# Altium schematic sheet DVI.SchDoc: Iris
size A3; Organization: Toradex AG; Address1: Altsagenstrasse 5; Address2: Horw; Address3: 6048; Address4: Switzerland; DocumentNumber: 11; Revision: V2.0; SheetNumber: 11; SheetTotal: 16
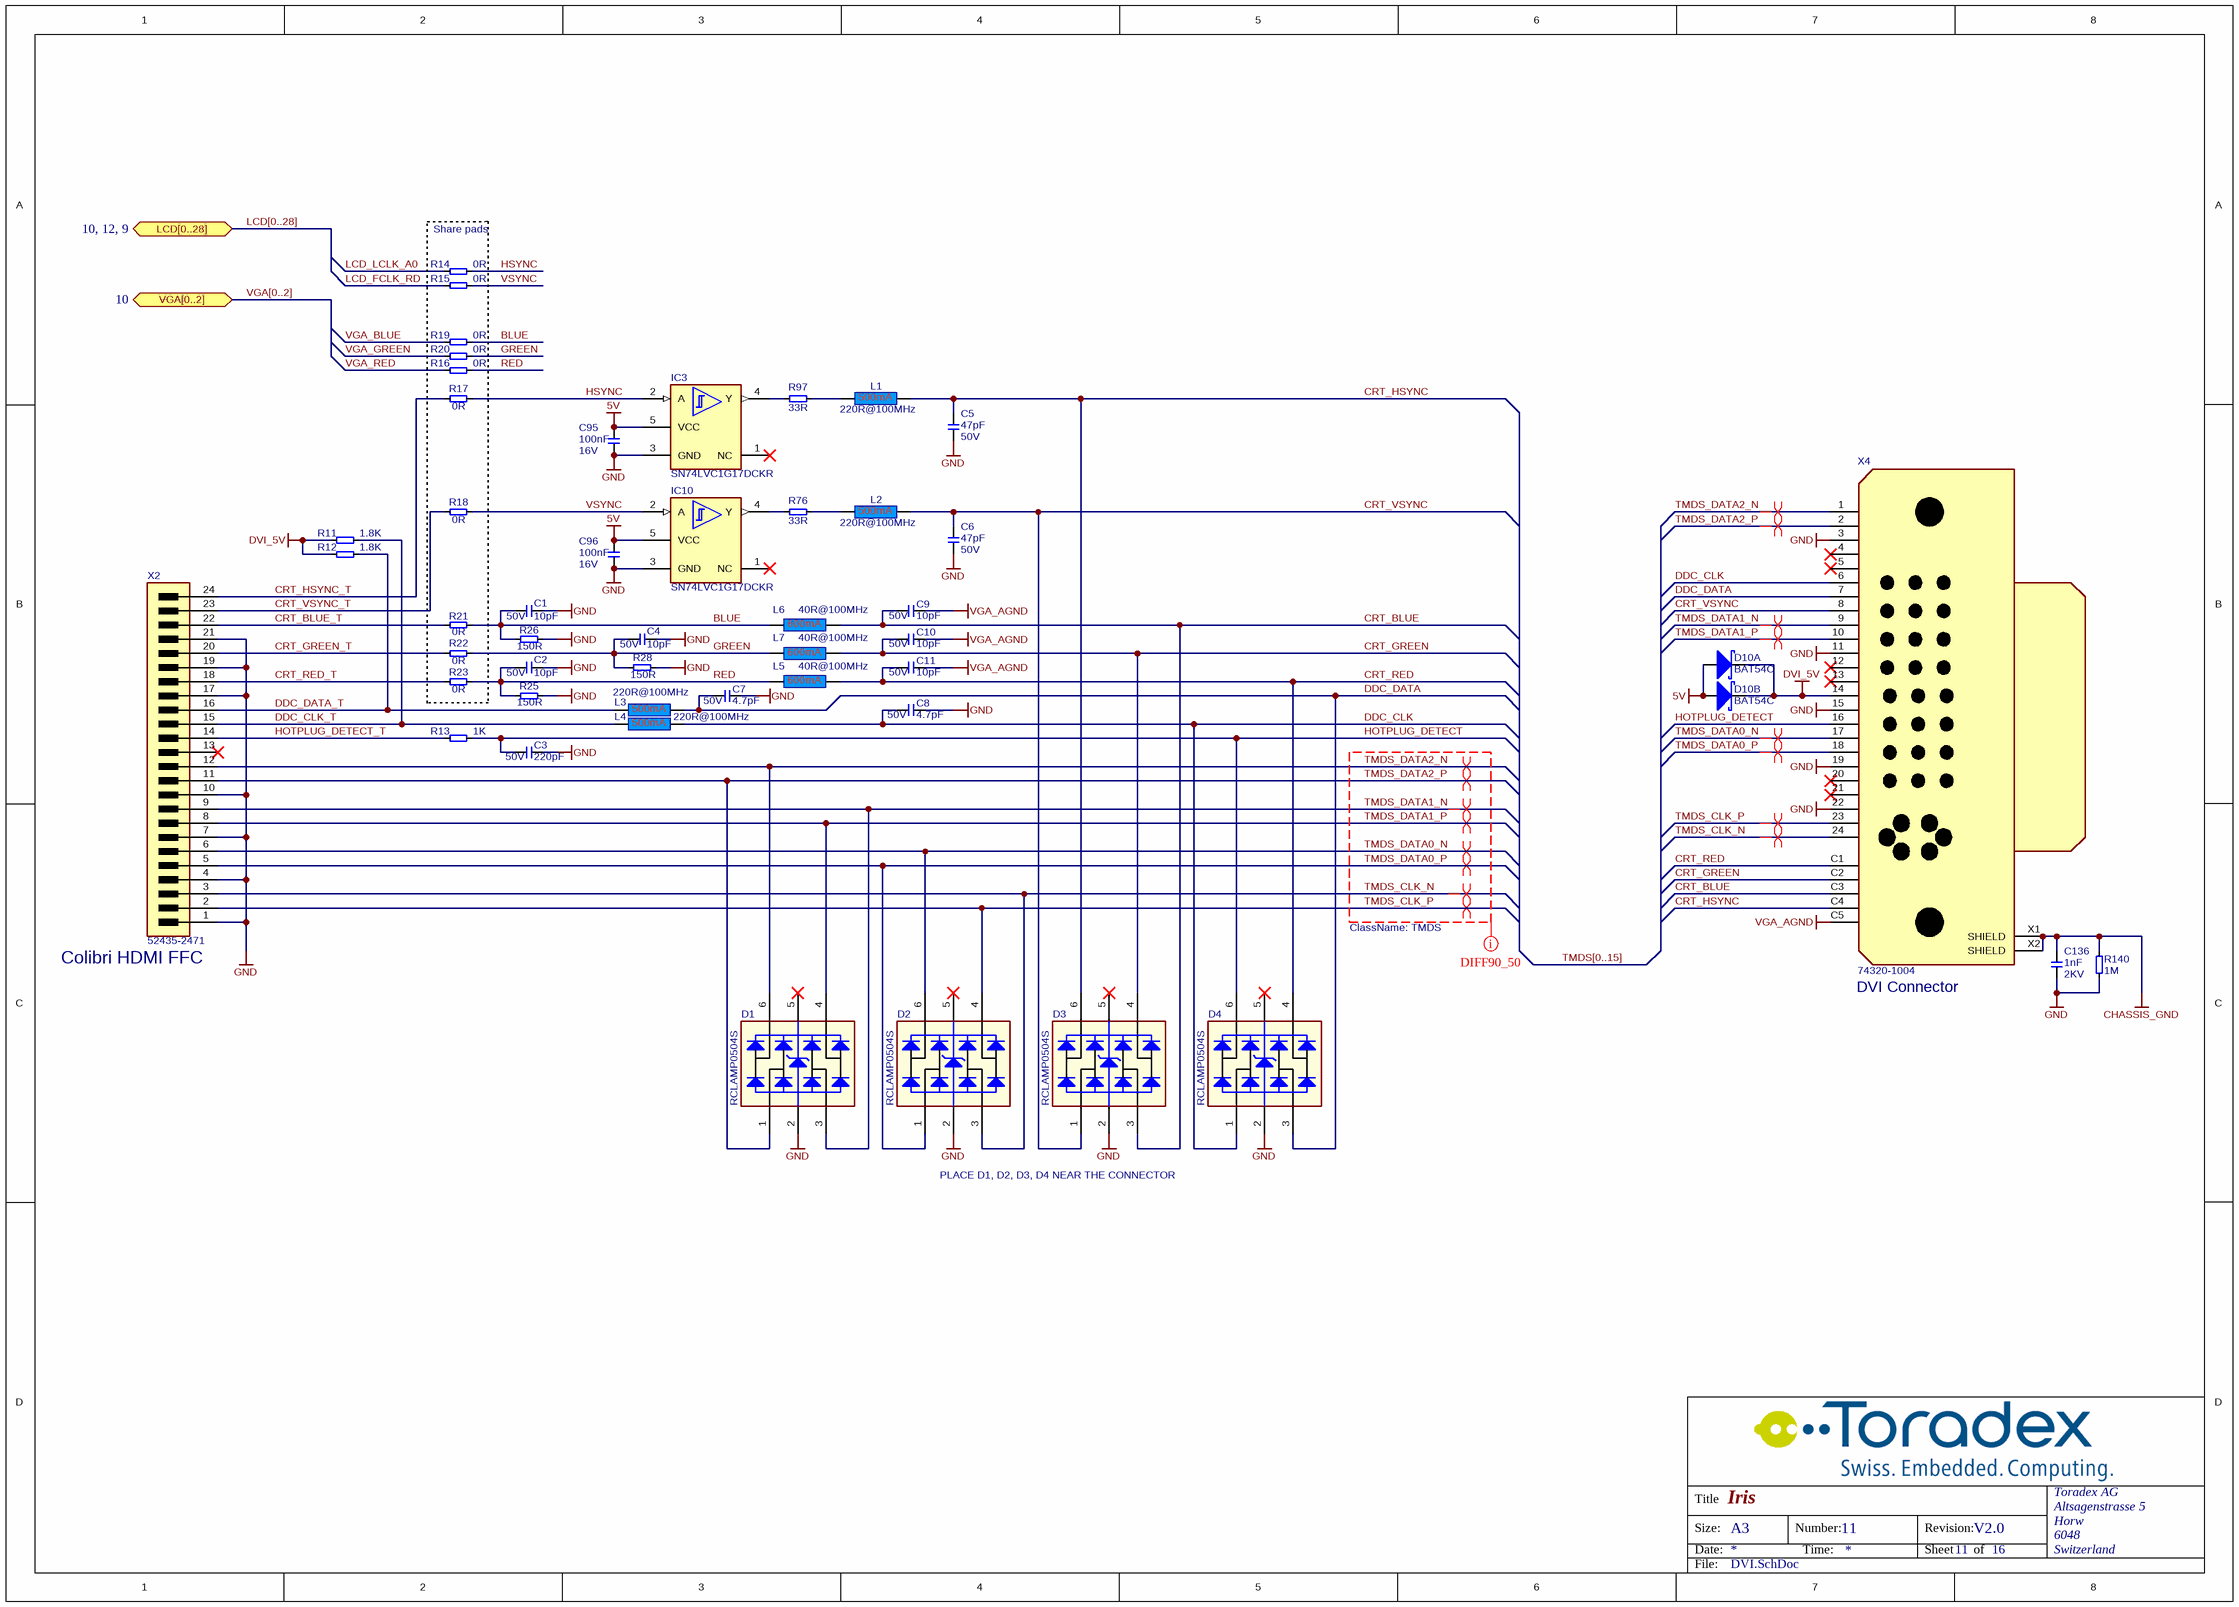
[diagram p0: DVI.SchDoc]

## Parts
C1  Rating: 50V  [CAPC1005X60N]  (hidden comment: 10pF)
C2  Rating: 50V  [CAPC1005X60N]  (hidden comment: 10pF)
C3  Rating: 50V  [CAPC1005X60N]  (hidden comment: 220pF)
C4  Rating: 50V  [CAPC1005X60N]  (hidden comment: 10pF)
C5  Rating: 50V  [CAPC1005X60N]  (hidden comment: 47pF)
C6  Rating: 50V  [CAPC1005X60N]  (hidden comment: 47pF)
C7  Rating: 50V  [CAPC1005X60N]  (hidden comment: 4.7pF)
C8  Rating: 50V  [CAPC1005X60N]  (hidden comment: 4.7pF)
C9  Rating: 50V  [CAPC1005X60N]  (hidden comment: 10pF)
C10  Rating: 50V  [CAPC1005X60N]  (hidden comment: 10pF)
C11  Rating: 50V  [CAPC1005X60N]  (hidden comment: 10pF)
C95  Rating: 16V  [CAPC1005X60N]  (hidden comment: 100nF)
C96  Rating: 16V  [CAPC1005X60N]  (hidden comment: 100nF)
C136  Rating: 2KV  [T_CAPC1206X180N]  (hidden comment: 1nF)
D1  RCLAMP0504S  [T_SOT95P285X90-6N]
D2  RCLAMP0504S  [T_SOT95P285X90-6N]
D3  RCLAMP0504S  [T_SOT95P285X90-6N]
D4  RCLAMP0504S  [T_SOT95P285X90-6N]
D10  BAT54C  [SOT95P230X110-3N]  (parts A,B of 2)
IC3  SN74LVC1G17DCKR  [SOT65P210X110-5N]
IC10  SN74LVC1G17DCKR  [SOT65P210X110-5N]
L1  220R@100MHz  [INDC1005X55N]
L2  220R@100MHz  [INDC1005X55N]
L3  220R@100MHz  [INDC1005X55N]
L4  220R@100MHz  [INDC1005X55N]
L5  40R@100MHz  [INDC1608X95N]
L6  40R@100MHz  [INDC1608X95N]
L7  40R@100MHz  [INDC1608X95N]
R11  1.8K  [RESC1005X40N]
R12  1.8K  [RESC1005X40N]
R13  1K  [RESC1005X40N]
R14  0R  [T_RESC0603X30N]
R15  0R  [T_RESC0603X30N]
R16  0R  [T_RESC0603X30N]
R17  0R  [T_RESC0603X30N]
R18  0R  [T_RESC0603X30N]
R19  0R  [T_RESC0603X30N]
R20  0R  [T_RESC0603X30N]
R21  0R  [T_RESC0603X30N]
R22  0R  [T_RESC0603X30N]
R23  0R  [T_RESC0603X30N]
R25  150R  [RESC1005X40N]
R26  150R  [RESC1005X40N]
R28  150R  [RESC1005X40N]
R76  33R  [RESC1005X40N]
R97  33R  [RESC1005X40N]
R140  1M  [T_RESC0603X30N]
X2  52435-2471  [T_MOLEX_52435-2471]
X4  Manufacturer Part No.: 74320-1004  [T_MOLEX_74320-1004]  (hidden comment: CON-Molex-74320-1004-31)

## Blocks framed on the sheet
Share pads: R14-R23

## Ports
LCD[0..28] (bidir, see 10, 12, 9), VGA[0..2] (bidir, see 10)

## Nets
5V: C95.2 C96.2 D10.1 D10.2 IC3.5(VCC) IC10.5(VCC)
CHASSIS_GND: C136.2 R140.2 X4.X1(SHIELD) X4.X2(SHIELD)
DVI_5V: D10.3 R11.2 R12.2 X4.14(VDD_DVI)
GND: C1.2 C2.2 C3.2 C4.2 C5.2 C6.2 C7.2 C8.2 C95.1 C96.1 C136.1 D1.2 D2.2 D3.2 D4.2 IC3.3(GND) IC10.3(GND) R25.2 R26.2 R28.2 R140.1 X2.1(GND) X2.4(GND) X2.7(GND) X2.10(GND) X2.17(GND) X2.19(GND) X2.21(GND) X4.3(GND) X4.11(GND) X4.15(GND) X4.19(GND) X4.22(GND)
VGA_AGND: C9.2 C10.2 C11.2 X4.C5(GND)
BLUE: C1.1 L6.1 R19.1 R21.1 R26.1
CRT_BLUE: C9.1 D3.3 L6.2 X4.C3(CRT_BLUE)
CRT_BLUE_T: R21.2 X2.22(CRT_BLUE)
CRT_GREEN: C10.1 D3.4 L7.2 X4.C2(CRT_GREEN)
CRT_GREEN_T: R22.2 X2.20(CRT_GREEN)
CRT_HSYNC: C5.1 D3.6 L1.2 X4.C4(CRT_HSYNC)
CRT_HSYNC_T: R17.1 X2.24(CRT_HSYNC)
CRT_RED: C11.1 D4.4 L5.2 X4.C1(CRT_RED)
CRT_RED_T: R23.2 X2.18(CRT_RED)
CRT_VSYNC: C6.1 D3.1 L2.2 X4.8(CRT_VSYNC)
CRT_VSYNC_T: R18.1 X2.23(CRT_VSYNC)
DDC_CLK: C8.1 D4.1 L4.2 X4.6(DDC_CLK)
DDC_CLK_T: L4.1 R11.1 X2.15(DDC_CLK)
DDC_DATA: C7.1 D4.3 L3.2 X4.7(DDC_DATA)
DDC_DATA_T: L3.1 R12.1 X2.16(DDC_DATA)
GREEN: C4.1 L7.1 R20.1 R22.1 R28.1
HOTPLUG_DETECT: C3.1 D4.6 R13.2 X4.16(HOTPLUG_DETECT)
HOTPLUG_DETECT_T: R13.1 X2.14(HOTPLUG_DETECT)
HSYNC: IC3.2(A) R14.2 R17.2
LCD_FCLK_RD: R15.1
LCD_LCLK_A0: R14.1
RED: C2.1 L5.1 R16.1 R23.1 R25.1
TMDS_CLK_N: D2.3 X2.3(TMDS_CLK_N) X4.24(TMDS_CLK_N)
TMDS_CLK_P: D2.4 X2.2(TMDS_CLK_P) X4.23(TMDS_CLK_P)
TMDS_DATA0_N: D2.6 X2.6(TMDS_DATA0_N) X4.17(TMDS_DATA0_N)
TMDS_DATA0_P: D2.1 X2.5(TMDS_DATA0_P) X4.18(TMDS_DATA0_P)
TMDS_DATA1_N: D1.3 X2.9(TMDS_DATA1_N) X4.9(TMDS_DATA1_N)
TMDS_DATA1_P: D1.4 X2.8(TMDS_DATA1_P) X4.10(TMDS_DATA1_P)
TMDS_DATA2_N: D1.6 X2.12(TMDS_DATA2_N) X4.1(TMDS_DATA2_N)
TMDS_DATA2_P: D1.1 X2.11(TMDS_DATA2_P) X4.2(TMDS_DATA2_P)
VGA_BLUE: R19.2
VGA_GREEN: R20.2
VGA_RED: R16.2
VSYNC: IC10.2(A) R15.2 R18.2
NetIC3_4: IC3.4(Y) R97.1
NetIC10_4: IC10.4(Y) R76.1
NetL1_1: L1.1 R97.2
NetL2_1: L2.1 R76.2

Not connected (* = marked no-connect by the designer): D1 5*; D2 5*; D3 5*; D4 5*; IC3 1(NC)*; IC10 1(NC)*; X2 13(VDD)*; X4 4(TMDS_DATA4_N)* 5(TMDS_DATA4_P)* 12(TMDS_DATA3_N)* 13(TMDS_DATA3_P)* 20(TMDS_DATA5_N)* 21(TMDS_DATA5_P)*

## Buses and harness runs
bus LCD[0..28] = port LCD[0..28]
bus TMDS[0..15]
bus VGA[0..2] = port VGA[0..2]

## Layout directives
differential pair: TMDS_CLK_N, TMDS_CLK_P, TMDS_DATA0_N, TMDS_DATA0_P, TMDS_DATA1_N, TMDS_DATA1_P, TMDS_DATA2_N, TMDS_DATA2_P
net class TMDS: TMDS_CLK_N, TMDS_CLK_P, TMDS_DATA0_N, TMDS_DATA0_P, TMDS_DATA1_N, TMDS_DATA1_P, TMDS_DATA2_N, TMDS_DATA2_P

## Notes on the sheet
- (near X2) Colibri HDMI FFC
- (near X4) DVI Connector
- PLACE D1, D2, D3, D4 NEAR THE CONNECTOR
- Title
- Size:
- Date:
- A3
- Number:
- Time:
- Revision:
- Sheet
- of
- File:

## Library data of the parts
C1 C2 C4 C9-C11 = C-NP0-10pF-50V-10%-0402: Capacitor Ceramic NP0 10pF 50V 10% 0402; Tolerance: 10%; Type: NP0; Value: 10pF
C3 = C-X7R-220pF-50V-10%-0402: Capacitor Ceramic X7R 220pF 50V 10% 0402; Tolerance: 10%; Type: X7R; Value: 220pF
C5 C6 = C-NP0-47pF-50V-5%-0402: Capacitor Ceramic NP0 47pF 50V 5% 0402; Tolerance: 5%; Type: NP0; Value: 47pF
C7 C8 = C-NP0-4.7pF-50V-10%-0402: Capacitor Ceramic NP0  4.7pF 50V 10% 0402; Tolerance: 10%; Type: NP0; Value: 4.7pF
C95 C96 = C-X7R-100nF-16V-10%-0402: Capacitor Ceramic X7R 100nF 16V 10% 0402; Tolerance: 10%; Type: X7R; Value: 100nF
C136 = C-X7R-1nF-2KV-10%-1206: Capacitor Ceramic X7R 1nF 2KV 10% 1206; Tolerance: 10%; Type: X7R; Value: 1nF
D1-D4 = D-Semtech-RClamp0504S: TVS Array low cap; Manufacturer Name: Semtech; Manufacturer Part No.: RCLAMP0504S
D10 = D-Philips-BAT54C-Schottky: BAT54C Schottky Diode; Manufacturer Name: Philips; Manufacturer Part No.: BAT54C
IC3 IC10 = IC-TI-SN74LVC1G17DCKR: Schmitt Trigger Buffer, SO-70 package; Manufacturer Name: Texas Instruments; Manufacturer Part No.: SN74LVC1G17DCKR
L1-L4 = L-220R@100MHz-500mA-25%-0402: Ferrite Bead, 220R@100MHz, 500mA, 0402 (1005 metric); Tolerance: 25%; Rating: 500mA; Value: 220R@100MHz
L5-L7 = L-TDK-MMZ1608S400A-40R@100MHz-600mA-25%-0603: 40R@100MHz 600mA EMI FILTER; Manufacturer Name: TDK; Tolerance: 25%; Rating: 600mA; Manufacturer Part No.: MMZ1608S400A; Value: 40R@100MHz
R11 R12 = R-1.8KR-63mW-5%-0402: Resistor 1.8 Kohm 63mW 5% 0402; Value: 1.8KR; Rating: 63mW; Tolerance: 5%
R13 = R-1KR-63mW-5%-0402: Resistor 1 Kohm 63mW 5% 0402; Rating: 63mW; Tolerance: 5%; Value: 1K
R14-R23 = R-0R-63mW-5%-0603: Resistor 0 ohm 63mW 5% 0603; Tolerance: 5%; Value: 0R; Rating: 63mW; Size: 0603 (In)
R25 R26 R28 = R-150R-63mW-5%-0402: Resistor 150 ohm 63mW 5% 0402; Rating: 63mW; Tolerance: 5%; Value: 150R
R76 R97 = R-33R-63mW-5%-0402: Resistor 33 ohm 63mW 5% 0402; Rating: 63mW; Tolerance: 5%; Value: 33R
R140 = R-1MR-63mW-5%-0603: Resistor 1 Mohm 63mW 5% 0603; Value: 1MR; Rating: 63mW; Tolerance: 5%
X2 = CON-Molex-52435-2471-24-0.5mm: 0.50mm Pitch FFC/FPC DVI Connector; Manufacturer Name: Molex; No. of ways: 24; Pitch: 0.5mm; Manufacturer Part No.: 52435-2471
X4 = CON-Molex-74320-1004-31: DVI Connector; Manufacturer Name: Molex; No. of ways: 31